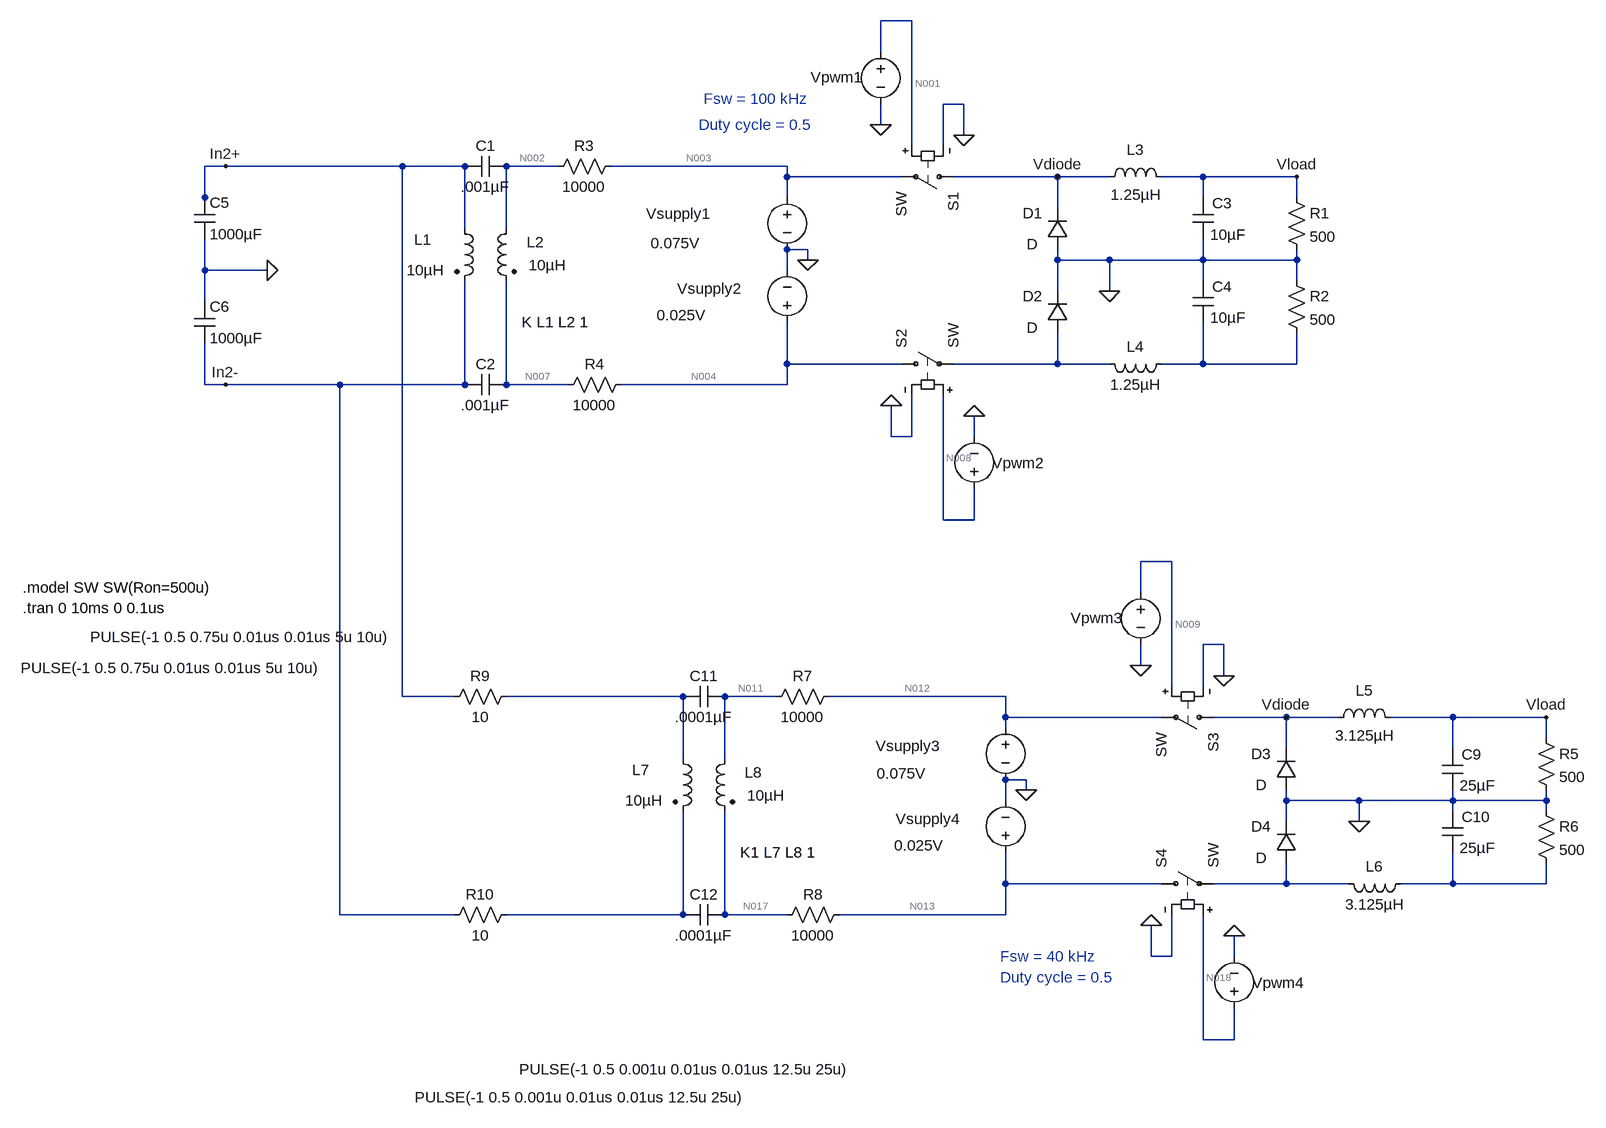
[diagram p0: schematic AC Power Flow ver2.6 (CM-DM AP1-AP2 Coupled) .asc]
AC Power Flow ver2.6 (CM-DM AP1-AP2 Coupled) .asc, the LTspice schematic file:
Version 4
SHEET 1 2292 1408
WIRE 1232 -320 1184 -320
WIRE 1184 -272 1184 -320
WIRE 1312 -192 1280 -192
WIRE 1184 -160 1184 -192
WIRE 1312 -144 1312 -192
WIRE 1232 -128 1232 -320
WIRE 1280 -128 1280 -192
WIRE 176 -96 144 -96
WIRE 448 -96 176 -96
WIRE 544 -96 448 -96
WIRE 688 -96 608 -96
WIRE 1040 -96 768 -96
WIRE 1040 -80 1040 -96
WIRE 1216 -80 1040 -80
WIRE 1456 -80 1296 -80
WIRE 1536 -80 1456 -80
WIRE 1680 -80 1616 -80
WIRE 1824 -80 1680 -80
WIRE 144 -48 144 -96
WIRE 1040 -48 1040 -80
WIRE 1680 -48 1680 -80
WIRE 1824 -48 1824 -80
WIRE 144 -32 144 -48
WIRE 1456 -32 1456 -80
WIRE 544 0 544 -96
WIRE 608 0 608 -96
WIRE 1072 32 1040 32
WIRE 1072 48 1072 32
WIRE 1456 48 1456 32
WIRE 1536 48 1456 48
WIRE 1680 48 1680 16
WIRE 1680 48 1536 48
WIRE 1824 48 1824 32
WIRE 1824 48 1680 48
WIRE 144 64 144 16
WIRE 240 64 144 64
WIRE 1040 64 1040 32
WIRE 1680 80 1680 48
WIRE 1824 80 1824 48
WIRE 1456 96 1456 48
WIRE 1536 96 1536 48
WIRE 144 112 144 64
WIRE 1040 208 1040 144
WIRE 1216 208 1040 208
WIRE 1456 208 1456 160
WIRE 1456 208 1296 208
WIRE 1536 208 1456 208
WIRE 1680 208 1680 144
WIRE 1680 208 1616 208
WIRE 1824 208 1824 160
WIRE 1824 208 1680 208
WIRE 144 240 144 176
WIRE 176 240 144 240
WIRE 352 240 176 240
WIRE 544 240 544 80
WIRE 544 240 352 240
WIRE 608 240 608 80
WIRE 704 240 608 240
WIRE 1040 240 1040 208
WIRE 1040 240 784 240
WIRE 1200 320 1200 272
WIRE 1232 320 1232 256
WIRE 1232 320 1200 320
WIRE 1328 320 1328 288
WIRE 1280 448 1280 256
WIRE 1328 448 1328 400
WIRE 1328 448 1280 448
WIRE 1632 512 1584 512
WIRE 1584 560 1584 512
WIRE 1712 640 1680 640
WIRE 1584 672 1584 640
WIRE 1712 688 1712 640
WIRE 1632 704 1632 512
WIRE 1680 704 1680 640
WIRE 448 720 448 -96
WIRE 528 720 448 720
WIRE 880 720 608 720
WIRE 1024 720 944 720
WIRE 1376 720 1104 720
WIRE 1376 752 1376 720
WIRE 1616 752 1376 752
WIRE 1808 752 1696 752
WIRE 1888 752 1808 752
WIRE 2064 752 1968 752
WIRE 2208 752 2064 752
WIRE 1376 768 1376 752
WIRE 2208 784 2208 752
WIRE 1808 800 1808 752
WIRE 2064 800 2064 752
WIRE 880 816 880 720
WIRE 944 816 944 720
WIRE 1408 848 1376 848
WIRE 1408 864 1408 848
WIRE 1376 880 1376 848
WIRE 1808 880 1808 864
WIRE 1920 880 1808 880
WIRE 2064 880 2064 864
WIRE 2064 880 1920 880
WIRE 2208 880 2208 864
WIRE 2208 880 2064 880
WIRE 2064 896 2064 880
WIRE 2208 896 2208 880
WIRE 1808 912 1808 880
WIRE 1920 912 1920 880
WIRE 1376 1008 1376 960
WIRE 1616 1008 1376 1008
WIRE 1808 1008 1808 976
WIRE 1808 1008 1696 1008
WIRE 1904 1008 1808 1008
WIRE 2064 1008 2064 960
WIRE 2064 1008 1984 1008
WIRE 2208 1008 2208 976
WIRE 2208 1008 2064 1008
WIRE 352 1056 352 240
WIRE 528 1056 352 1056
WIRE 880 1056 880 896
WIRE 880 1056 608 1056
WIRE 944 1056 944 896
WIRE 1040 1056 944 1056
WIRE 1376 1056 1376 1008
WIRE 1376 1056 1120 1056
WIRE 1600 1120 1600 1072
WIRE 1632 1120 1632 1056
WIRE 1632 1120 1600 1120
WIRE 1728 1120 1728 1088
WIRE 1680 1248 1680 1056
WIRE 1728 1248 1728 1200
WIRE 1728 1248 1680 1248
FLAG 240 64 0
FLAG 176 -96 In2+
FLAG 176 240 In2-
FLAG 1072 48 0
FLAG 1312 -144 0
FLAG 1824 -80 Vload
FLAG 1184 -160 0
FLAG 1456 -80 Vdiode
FLAG 1200 272 0
FLAG 1328 288 0
FLAG 1536 96 0
FLAG 1712 688 0
FLAG 2208 752 Vload
FLAG 1584 672 0
FLAG 1808 752 Vdiode
FLAG 1600 1072 0
FLAG 1728 1088 0
FLAG 1920 912 0
FLAG 1408 864 0
SYMBOL ind2 528 -16 R0
WINDOW 0 -62 33 Left 2
WINDOW 3 -73 80 Left 2
SYMATTR InstName L1
SYMATTR Value 10µH
SYMATTR Type ind
SYMBOL ind2 624 -16 M0
WINDOW 0 -42 37 Left 2
WINDOW 3 -76 72 Left 2
SYMATTR InstName L2
SYMATTR Value 10µH
SYMATTR Type ind
SYMBOL cap 608 -112 R90
WINDOW 0 0 32 VBottom 2
WINDOW 3 32 32 VTop 2
SYMATTR InstName C1
SYMATTR Value .001µF
SYMBOL cap 608 224 R90
WINDOW 0 0 32 VBottom 2
WINDOW 3 32 32 VTop 2
SYMATTR InstName C2
SYMATTR Value .001µF
SYMBOL sw 1312 -80 R90
SYMATTR InstName S1
SYMBOL voltage 1040 -64 R0
WINDOW 3 -210 86 Left 2
WINDOW 123 0 0 Left 2
WINDOW 39 0 0 Left 2
WINDOW 0 -217 41 Left 2
SYMATTR Value 0.075V
SYMATTR InstName Vsupply1
SYMBOL res 1808 -64 R0
SYMATTR InstName R1
SYMATTR Value 500
SYMBOL voltage 1184 -288 R0
WINDOW 3 -752 916 Right 2
WINDOW 123 0 0 Left 2
WINDOW 39 0 0 Left 2
WINDOW 0 -108 55 Left 2
SYMATTR Value PULSE(-1 0.5 0.75u 0.01us 0.01us 5u 10u)
SYMATTR InstName Vpwm1
SYMBOL diode 1472 32 R180
WINDOW 0 39 56 Left 2
WINDOW 3 46 8 Left 2
SYMATTR InstName D1
SYMBOL ind 1520 -64 R270
WINDOW 0 42 56 VTop 2
WINDOW 3 4 57 VBottom 2
SYMATTR InstName L3
SYMATTR Value 1.25µH
SYMBOL cap 1664 -48 R0
WINDOW 0 30 9 Left 2
WINDOW 3 27 57 Left 2
SYMATTR InstName C3
SYMATTR Value 10µF
SYMBOL voltage 1040 160 R180
WINDOW 3 124 27 Left 2
WINDOW 123 0 0 Left 2
WINDOW 39 0 0 Left 2
WINDOW 0 70 68 Left 2
SYMATTR Value 0.025V
SYMATTR InstName Vsupply2
SYMBOL ind 1632 192 R90
WINDOW 0 5 56 VBottom 2
WINDOW 3 32 56 VTop 2
SYMATTR InstName L4
SYMATTR Value 1.25µH
SYMBOL cap 1664 80 R0
WINDOW 0 30 9 Left 2
WINDOW 3 27 57 Left 2
SYMATTR InstName C4
SYMATTR Value 10µF
SYMBOL res 1808 64 R0
SYMATTR InstName R2
SYMATTR Value 500
SYMBOL diode 1472 160 R180
WINDOW 0 39 56 Left 2
WINDOW 3 46 8 Left 2
SYMATTR InstName D2
SYMBOL sw 1200 208 R270
SYMATTR InstName S2
SYMBOL voltage 1328 416 R180
WINDOW 3 1467 -260 Right 2
WINDOW 123 0 0 Left 2
WINDOW 39 0 0 Left 2
WINDOW 0 -108 55 Left 2
SYMATTR Value PULSE(-1 0.5 0.75u 0.01us 0.01us 5u 10u)
SYMATTR InstName Vpwm2
SYMBOL cap 128 -48 R0
SYMATTR InstName C5
SYMATTR Value 1000µF
SYMBOL cap 128 112 R0
SYMATTR InstName C6
SYMATTR Value 1000µF
SYMBOL res 672 -80 R270
WINDOW 0 32 56 VTop 2
WINDOW 3 0 56 VBottom 2
SYMATTR InstName R3
SYMATTR Value 10000
SYMBOL res 688 256 R270
WINDOW 0 32 56 VTop 2
WINDOW 3 0 56 VBottom 2
SYMATTR InstName R4
SYMATTR Value 10000
SYMBOL sw 1712 752 R90
SYMATTR InstName S3
SYMBOL res 2192 768 R0
SYMATTR InstName R5
SYMATTR Value 500
SYMBOL diode 1824 864 R180
WINDOW 0 39 56 Left 2
WINDOW 3 46 8 Left 2
SYMATTR InstName D3
SYMBOL ind 1872 768 R270
WINDOW 0 42 56 VTop 2
WINDOW 3 4 57 VBottom 2
SYMATTR InstName L5
SYMATTR Value 3.125µH
SYMBOL cap 2048 800 R0
WINDOW 0 30 9 Left 2
WINDOW 3 27 57 Left 2
SYMATTR InstName C9
SYMATTR Value 25µF
SYMBOL voltage 1584 544 R0
WINDOW 3 -445 750 Right 2
WINDOW 123 0 0 Left 2
WINDOW 39 0 0 Left 2
WINDOW 0 -108 55 Left 2
SYMATTR Value PULSE(-1 0.5 0.001u 0.01us 0.01us 12.5u 25u)
SYMATTR InstName Vpwm3
SYMBOL ind 2000 992 R90
WINDOW 0 5 56 VBottom 2
WINDOW 3 32 56 VTop 2
SYMATTR InstName L6
SYMATTR Value 3.125µH
SYMBOL cap 2048 896 R0
WINDOW 0 30 9 Left 2
WINDOW 3 27 57 Left 2
SYMATTR InstName C10
SYMATTR Value 25µF
SYMBOL res 2192 880 R0
SYMATTR InstName R6
SYMATTR Value 500
SYMBOL diode 1824 976 R180
WINDOW 0 39 56 Left 2
WINDOW 3 46 8 Left 2
SYMATTR InstName D4
SYMBOL sw 1600 1008 R270
SYMATTR InstName S4
SYMBOL voltage 1728 1216 R180
WINDOW 3 1261 -121 Right 2
WINDOW 123 0 0 Left 2
WINDOW 39 0 0 Left 2
WINDOW 0 -108 55 Left 2
SYMATTR Value PULSE(-1 0.5 0.001u 0.01us 0.01us 12.5u 25u)
SYMATTR InstName Vpwm4
SYMBOL ind2 864 800 R0
WINDOW 0 -62 33 Left 2
WINDOW 3 -73 80 Left 2
SYMATTR InstName L7
SYMATTR Value 10µH
SYMATTR Type ind
SYMBOL ind2 960 800 M0
WINDOW 0 -42 37 Left 2
WINDOW 3 -76 72 Left 2
SYMATTR InstName L8
SYMATTR Value 10µH
SYMATTR Type ind
SYMBOL cap 944 704 R90
WINDOW 0 0 32 VBottom 2
WINDOW 3 32 32 VTop 2
SYMATTR InstName C11
SYMATTR Value .0001µF
SYMBOL cap 944 1040 R90
WINDOW 0 0 32 VBottom 2
WINDOW 3 32 32 VTop 2
SYMATTR InstName C12
SYMATTR Value .0001µF
SYMBOL voltage 1376 752 R0
WINDOW 3 -198 86 Left 2
WINDOW 123 0 0 Left 2
WINDOW 39 0 0 Left 2
WINDOW 0 -200 44 Left 2
SYMATTR Value 0.075V
SYMATTR InstName Vsupply3
SYMBOL voltage 1376 976 R180
WINDOW 3 95 27 Left 2
WINDOW 123 0 0 Left 2
WINDOW 39 0 0 Left 2
WINDOW 0 70 68 Left 2
SYMATTR Value 0.025V
SYMATTR InstName Vsupply4
SYMBOL res 1008 736 R270
WINDOW 0 32 56 VTop 2
WINDOW 3 0 56 VBottom 2
SYMATTR InstName R7
SYMATTR Value 10000
SYMBOL res 1024 1072 R270
WINDOW 0 32 56 VTop 2
WINDOW 3 0 56 VBottom 2
SYMATTR InstName R8
SYMATTR Value 10000
SYMBOL res 624 704 R90
WINDOW 0 0 56 VBottom 2
WINDOW 3 32 56 VTop 2
SYMATTR InstName R9
SYMATTR Value 10
SYMBOL res 624 1040 R90
WINDOW 0 0 56 VBottom 2
WINDOW 3 32 56 VTop 2
SYMATTR InstName R10
SYMATTR Value 10
TEXT 632 144 Left 2 !K L1 L2 1
TEXT -136 584 Left 2 !.tran 0 10ms 0 0.1us
TEXT -136 552 Left 2 !.model SW SW(Ron=500u)
TEXT 912 -200 Left 2 ;Fsw = 100 kHz
TEXT 904 -160 Left 2 ;Duty cycle = 0.5
TEXT 1368 1120 Left 2 ;Fsw = 40 kHz
TEXT 1368 1152 Left 2 ;Duty cycle = 0.5
TEXT 968 960 Left 2 !K1 L7 L8 1

The netlist it stands for:
* AC Power Flow ver2.6 (CM-DM AP1-AP2 Coupled) .asc
L1 In2+ In2- 10µH
L2 N002 N007 10µH
C1 N002 In2+ .001µF
C2 N007 In2- .001µF
S1 Vdiode N003 N001 0 SW
Vsupply1 N003 0 0.075V
R1 Vload 0 500
Vpwm1 N001 0 PULSE(-1 0.5 0.75u 0.01us 0.01us 5u 10u)
D1 0 Vdiode D
L3 Vdiode Vload 1.25µH
C3 Vload 0 10µF
Vsupply2 N004 0 0.025V
L4 N006 N005 1.25µH
C4 0 N006 10µF
R2 0 N006 500
D2 N005 0 D
S2 N004 N005 N008 0 SW
Vpwm2 N008 0 PULSE(-1 0.5 0.75u 0.01us 0.01us 5u 10u)
C5 In2+ 0 1000µF
C6 0 In2- 1000µF
R3 N002 N003 10000
R4 N007 N004 10000
S3 Vdiode N012 N009 0 SW
R5 Vload 0 500
D3 0 Vdiode D
L5 Vdiode Vload 3.125µH
C9 Vload 0 25µF
Vpwm3 N009 0 PULSE(-1 0.5 0.001u 0.01us 0.01us 12.5u 25u)
L6 N015 N014 3.125µH
C10 0 N015 25µF
R6 0 N015 500
D4 N014 0 D
S4 N013 N014 N018 0 SW
Vpwm4 N018 0 PULSE(-1 0.5 0.001u 0.01us 0.01us 12.5u 25u)
L7 N010 N016 10µH
L8 N011 N017 10µH
C11 N011 N010 .0001µF
C12 N017 N016 .0001µF
Vsupply3 N012 0 0.075V
Vsupply4 N013 0 0.025V
R7 N011 N012 10000
R8 N017 N013 10000
R9 N010 In2+ 10
R10 N016 In2- 10
.model D D
.lib standard.dio
K L1 L2 1
.tran 0 10ms 0 0.1us
.model SW SW(Ron=500u)
* Fsw = 100 kHz
* Duty cycle = 0.5
* Fsw = 40 kHz
* Duty cycle = 0.5
K1 L7 L8 1
.backanno
.end

* Results of the author's LTspice run, read from the files saved beside the schematic
* Operating Point, zero values left out:
*   V(n002) = 50 mV
*   V(n007) = 50 mV
*   V(n003) = 75 mV
*   V(n001) = -1 V
*   V(n004) = 25 mV
*   V(n008) = -1 V
*   V(n012) = 75 mV
*   V(n009) = -1 V
*   V(n013) = 25 mV
*   V(n018) = -1 V
*   V(n011) = 50 mV
*   V(n017) = 50 mV
*   I(L8) = 2.5 µA
*   I(L2) = 2.5 µA
*   I(R8) = 2.5 µA
*   I(R7) = -2.5 µA
*   I(R4) = 2.5 µA
*   I(R3) = -2.5 µA
*   I(Vsupply4) = 2.5 µA
*   I(Vsupply3) = -2.5 µA
*   I(Vsupply2) = 2.5 µA
*   I(Vsupply1) = -2.5 µA